# EAGLE design board_0.8v (EAGLE 7.7.0)
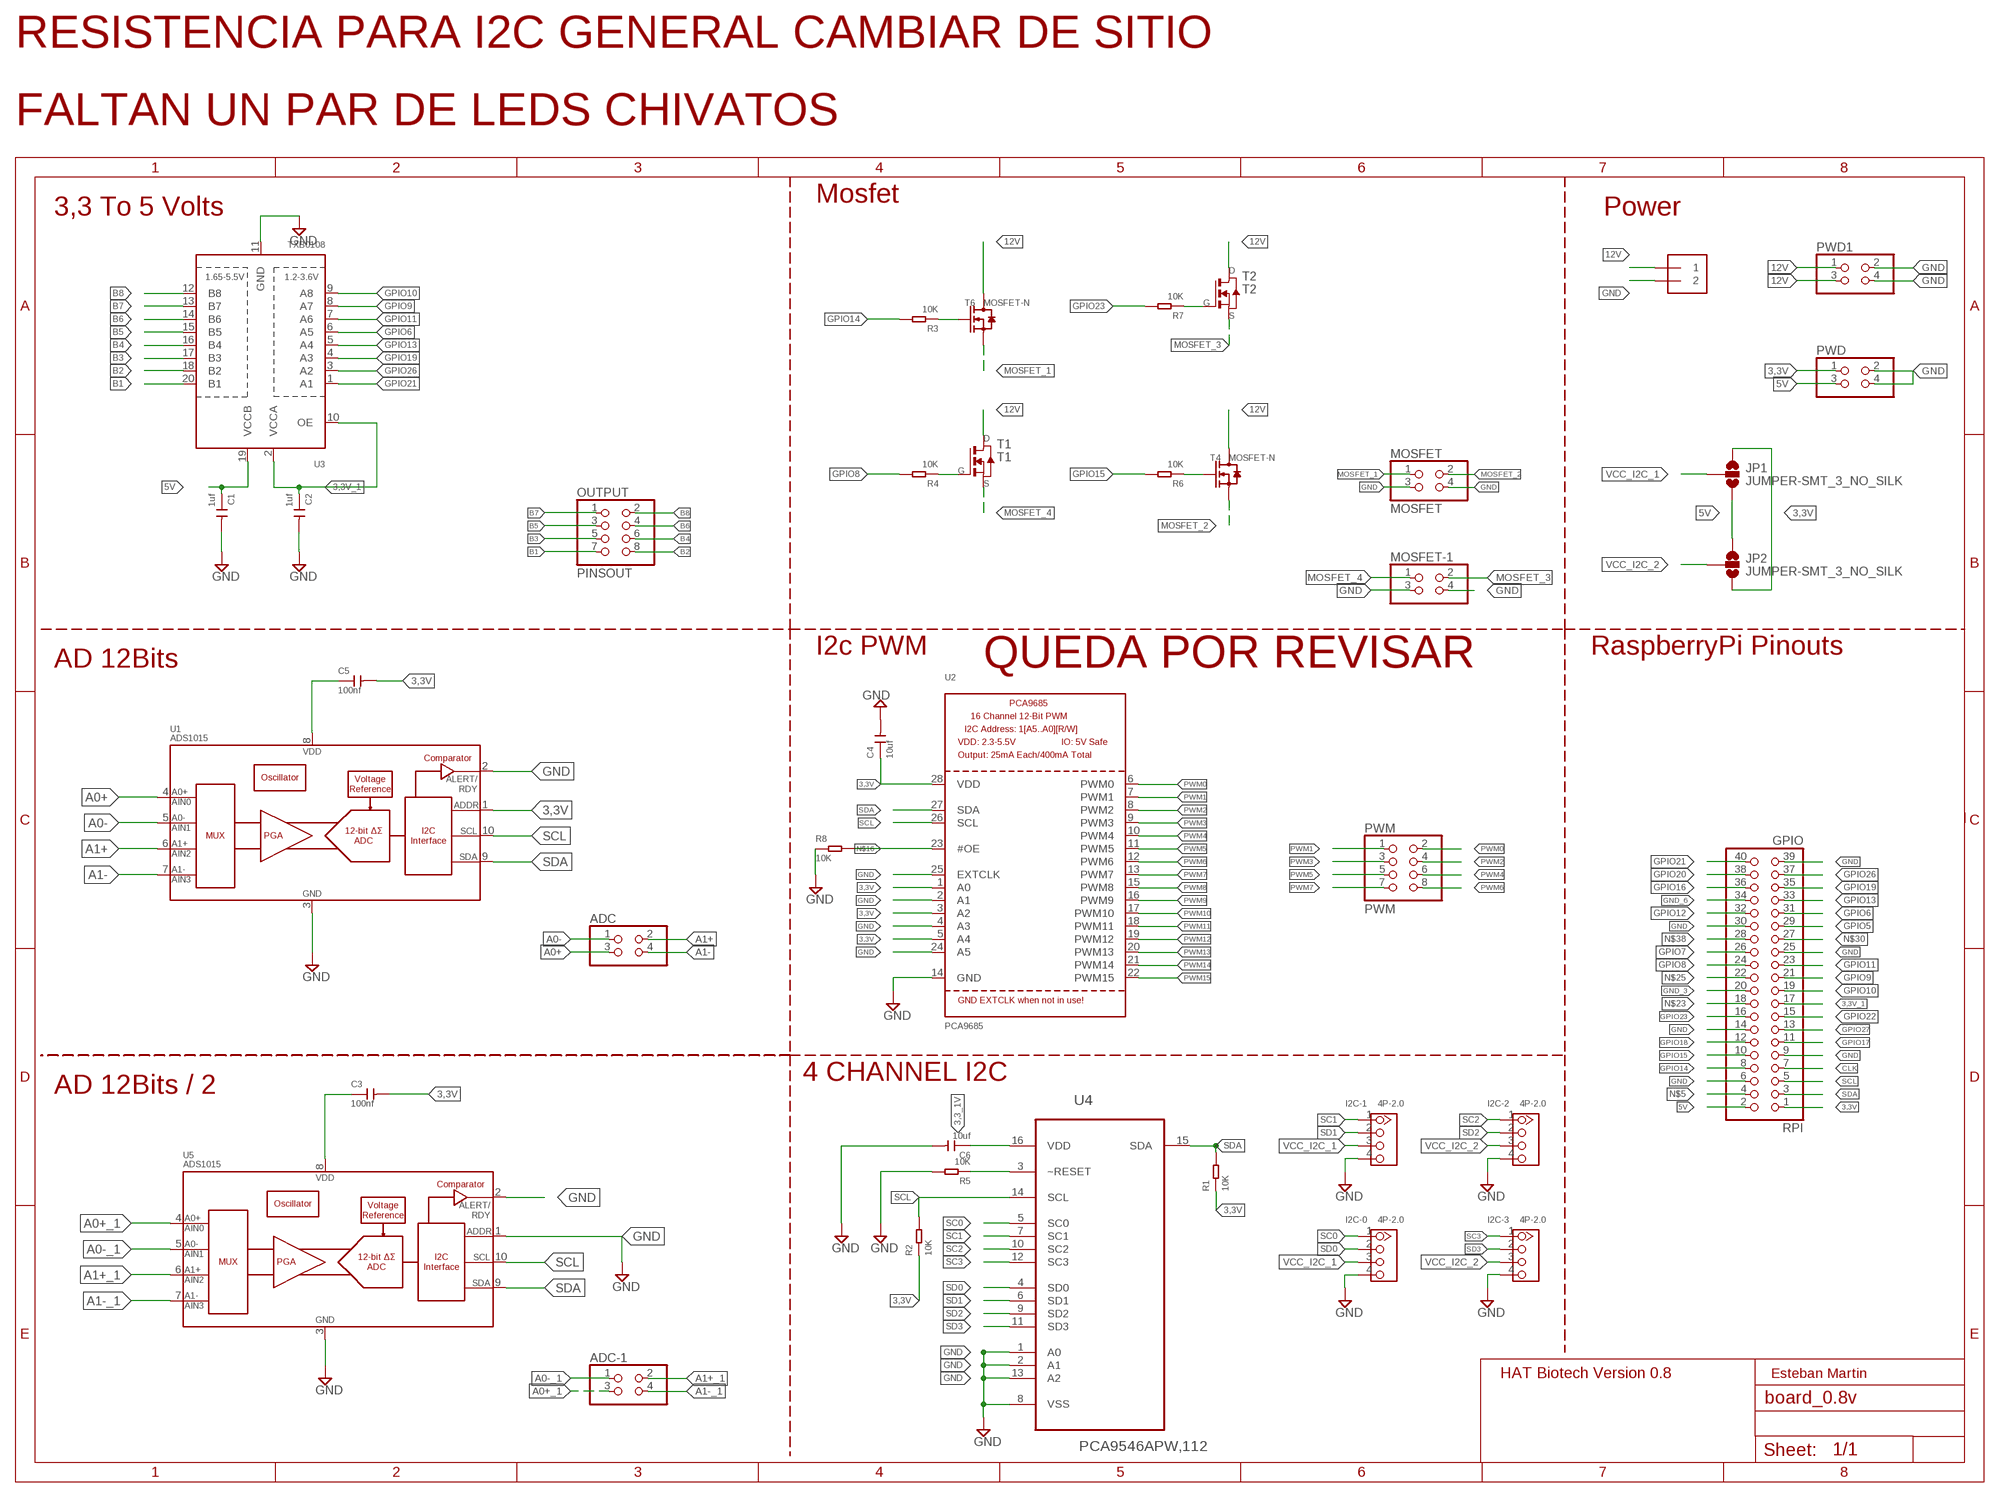
[diagram p0: schematic, sheet 1]

## Parts
ADC  PINHD-2X2  [2X02]
ADC-1  PINHD-2X2  [2X02]
C1  1uf  CERAMIC-1UF-25V-10%-X7R(0805)  [C0805]
C2  1uf  CERAMIC-1UF-25V-10%-X7R(0805)  [C0805]
C3  100nf  CERAMIC-100NF-50V-10%-X7R(0805)  [C0805]
C4  10uf  CERAMIC-1UF-25V-10%-X7R(0805)  [C0805]
C5  100nf  CERAMIC-100NF-50V-10%-X7R(0805)  [C0805]
C6  10uf  CERAMIC-1UF-25V-10%-X7R(0805)  [C0805]
I2C-0  4P-2.0  GROVE-CONNECTOR-DIP(4P-2.0)  [HW4-2.0]
I2C-1  4P-2.0  GROVE-CONNECTOR-DIP(4P-2.0)  [HW4-2.0]
I2C-2  4P-2.0  GROVE-CONNECTOR-DIP(4P-2.0)  [HW4-2.0]
I2C-3  4P-2.0  GROVE-CONNECTOR-DIP(4P-2.0)  [HW4-2.0]
INPUT  1X2-3.5MM  [1X2-3.5MM]
JP1  JUMPER-SMT_3_NO_SILK  [SMT-JUMPER_3_NO_SILK]
JP2  JUMPER-SMT_3_NO_SILK  [SMT-JUMPER_3_NO_SILK]
MOSFET  MOSFET  PINHD-2X2  [2X02]
MOSFET-1  PINHD-2X2  [2X02]
OUTPUT  PINSOUT  PINHD-2X4  [2X04]
PWD  PINHD-2X2  [2X02]
PWD1  PINHD-2X2  [2X02]
PWM  PWM  PINHD-2X4  [2X04]
R1  10K  SMD-RES-10K-1%-1/8W(0805)  [R0805]
R2  10K  SMD-RES-10K-1%-1/8W(0805)  [R0805]
R3  10K  SMD-RES-10K-1%-1/8W(0805)  [R0805]
R4  10K  SMD-RES-10K-1%-1/8W(0805)  [R0805]
R5  10K  SMD-RES-10K-1%-1/8W(0805)  [R0805]
R6  10K  SMD-RES-10K-1%-1/8W(0805)  [R0805]
R7  10K  SMD-RES-10K-1%-1/8W(0805)  [R0805]
R8  10K  SMD-RES-10K-1%-1/8W(0805)  [R0805]
RPI  GPIO  PINHD-2X20  [2X20]
T1  T1  NMOSFETTO252  [TO252]
T2  T2  NMOSFETTO252  [TO252]
T4  MOSFET-N  [SOT-23]
T6  MOSFET-N  [SOT-23]
U1  ADS1015  [MSOP10]
U2  PCA9685  [TSSOP28]
U3  TXB0108  TXB0108PWR  [TSSOP20]
U4  PCA9546APW,112  [SOP65P640X110-16N]
U5  ADS1015  [MSOP10]

## Nets
3,3_1V: C6.1 U4.16(VDD)
3,3V: C3.2 C4.1 C5.2 JP1.1 JP2.3 PWD.1 R1.1 R2.1 RPI.1 U1.1(ADDR) U2.1(A0) U2.3(A2) U2.5(A4) U2.28(VDD)
3,3V_1: C2.1 RPI.17 U3.2(VCCA) U3.10(OE)
5V: C1.1 JP1.3 JP2.1 PWD.3 RPI.2 U3.19(VCCB)
12V: INPUT.1 PWD1.1 PWD1.3 T1.3(D) T2.3(D) T4.3(D) T6.3(D)
A0+: ADC.3 U1.4(AIN0)
A0+_1: ADC-1.3 U5.4(AIN0)
A0-: ADC.1 U1.5(AIN1)
A0-_1: ADC-1.1 U5.5(AIN1)
A1+: ADC.2 U1.6(AIN2)
A1+_1: ADC-1.2 U5.6(AIN2)
A1-: ADC.4 U1.7(AIN3)
A1-_1: ADC-1.4 U5.7(AIN3)
B1: OUTPUT.7 U3.20(B1)
B2: OUTPUT.8 U3.18(B2)
B3: OUTPUT.5 U3.17(B3)
B4: OUTPUT.6 U3.16(B4)
B5: OUTPUT.3 U3.15(B5)
B6: OUTPUT.4 U3.14(B6)
B7: OUTPUT.1 U3.13(B7)
B8: OUTPUT.2 U3.12(B8)
CLK: RPI.7
GND: C1.2 C2.2 C4.2 C6.2 I2C-0.4 I2C-1.4 I2C-2.4 I2C-3.4 INPUT.2 MOSFET-1.3 MOSFET-1.4 MOSFET.3 MOSFET.4 PWD1.2 PWD1.4 PWD.2 PWD.4 R5.2 R8.1 RPI.6 RPI.9 RPI.14 RPI.25 RPI.30 RPI.39 U1.2(ALERT/RDY) U1.3(VSS) U2.2(A1) U2.4(A3) U2.14(GND) U2.24(A5) U2.25(EXTCLK) U3.11(GND) U4.1(A0) U4.2(A1) U4.8(VSS) U4.13(A2) U5.1(ADDR) U5.2(ALERT/RDY) U5.3(VSS)
GND_3: RPI.20
GND_6: RPI.34
GPIO5: RPI.29
GPIO6: RPI.31 U3.6(A5)
GPIO7: RPI.26
GPIO8: R4.2 RPI.24
GPIO9: RPI.21 U3.8(A7)
GPIO10: RPI.19 U3.9(A8)
GPIO11: RPI.23 U3.7(A6)
GPIO12: RPI.32
GPIO13: RPI.33 U3.5(A4)
GPIO14: R3.2 RPI.8
GPIO15: R6.2 RPI.10
GPIO16: RPI.36
GPIO17: RPI.11
GPIO18: RPI.12
GPIO19: RPI.35 U3.4(A3)
GPIO20: RPI.38
GPIO21: RPI.40 U3.1(A1)
GPIO22: RPI.15
GPIO23: R7.2 RPI.16
GPIO26: RPI.37 U3.3(A2)
GPIO27: RPI.13
MOSFET_1: MOSFET.1 T6.2(S)
MOSFET_2: MOSFET.2 T4.2(S)
MOSFET_3: MOSFET-1.2 T2.2(S)
MOSFET_4: MOSFET-1.1 T1.2(S)
N$5: RPI.4
N$6: R3.1 T6.1(G)
N$7: R5.1 U4.3(~RESET)
N$8: C3.1 U5.8(VDD)
N$9: R4.1 T1.1(G)
N$10: R6.1 T4.1(G)
N$11: R7.1 T2.1(G)
N$13: C5.1 U1.8(VDD)
N$16: R8.2 U2.23(#OE)
N$23: RPI.18
N$25: RPI.22
N$30: RPI.27
N$38: RPI.28
PWM0: PWM.2 U2.6(PWM0)
PWM1: PWM.1 U2.7(PWM1)
PWM2: PWM.4 U2.8(PWM2)
PWM3: PWM.3 U2.9(PWM3)
PWM4: PWM.6 U2.10(PWM4)
PWM5: PWM.5 U2.11(PWM5)
PWM6: PWM.8 U2.12(PWM6)
PWM7: PWM.7 U2.13(PWM7)
PWM8: U2.15(PWM8)
PWM9: U2.16(PWM9)
PWM10: U2.17(PWM10)
PWM11: U2.18(PWM11)
PWM12: U2.19(PWM12)
PWM13: U2.20(PWM13)
PWM14: U2.21(PWM14)
PWM15: U2.22(PWM15)
SC0: I2C-0.1 U4.5(SC0)
SC1: I2C-1.1 U4.7(SC1)
SC2: I2C-2.1 U4.10(SC2)
SC3: I2C-3.1 U4.12(SC3)
SCL: R2.2 RPI.5 U1.10(SCL) U2.26(SCL) U4.14(SCL) U5.10(SCL)
SD0: I2C-0.2 U4.4(SD0)
SD1: I2C-1.2 U4.6(SD1)
SD2: I2C-2.2 U4.9(SD2)
SD3: I2C-3.2 U4.11(SD3)
SDA: R1.2 RPI.3 U1.9(SDA) U2.27(SDA) U4.15(SDA) U5.9(SDA)
VCC_I2C_1: I2C-0.3 I2C-1.3 JP1.2
VCC_I2C_2: I2C-2.3 I2C-3.3 JP2.2

## Notes on the sheet
- RESISTENCIA PARA I2C GENERAL CAMBIAR DE SITIO
- FALTAN UN PAR DE LEDS CHIVATOS
- Mosfet
- 3,3 To 5 Volts | Power
- I2c PWM | RaspberryPi Pinouts
- AD 12Bits | QUEDA POR REVISAR
- 4 CHANNEL I2C
- AD 12Bits / 2
- HAT Biotech Version 0.8 | Esteban Martin

## Library data of the parts
ADC ADC-1 MOSFET MOSFET-1 PWD PWD1 = pinhead:PINHD-2X2: PIN HEADER
C1 C2 = Seeed-OPL-Capacitor:CERAMIC-1UF-25V-10%-X7R(0805): 302010179; MPN: CC0805KKX7R8BB105
C3 C5 = Seeed-OPL-Capacitor:CERAMIC-100NF-50V-10%-X7R(0805): 302010165; MPN: CC0805KRX7R9BB104
C4 C6 = Seeed-OPL-Capacitor:CERAMIC-1UF-25V-10%-X7R(0805): 302010179; MPN: CC0805KKX7R8BB105; VALUE: 1uf
I2C-0 I2C-1-I2C-3 = Seeed-OPL-Connector:GROVE-CONNECTOR-DIP(4P-2.0): 320110033
INPUT = adafruit:1X2: 3.5mm Terminal block http://www.ladyada.net/library/pcb/eaglelibrary.html
JP1 JP2 = SparkFun-Jumpers:JUMPER-SMT_3_NO: Normally open jumper This jumper has three pads in close proximity to each other. Apply solder to close the connection(s).
OUTPUT PWM = adafruit:PINHD-2X4: PIN HEADER
R1-R8 = Seeed-OPL-Resistor:SMD-RES-10K-1%-1/8W(0805): 301010361; MPN: RC0805FR-0710KL
RPI = adafruit:PINHD-2X20: PIN HEADER
T1 T2 = fab_2:NMOSFET: MOS FET
T4 T6 = Seeed-OPL-Transistor:MOSFET-N
U1 U5 = SparkFun-IC-Conversion:ADS1015: ADS1015 12-BIT ADC 12-Bit Del-Sig ADC Four single-ended inputs or two differential inputs Internal PGA I2C interface 2.0-5.5V SparkFun Products SparkFun Block for Intel Edison - ADC <https://www.sparkfun.com/products/13770> (DEV-13770); PROD_ID: IC-12270
U2 = adafruit:PCA9685: PCA9685 - 16 Channel 12-Bit I2C PWM Controller 5.0V tolerant 16 channel, 12-bit I2C PWM controller with 25mA per output (max. 400mA total) Digikey: 568-5931-1-ND
U3 = adafruit:TXB0108PWR: 8-Bit Bi-Directional Level Shifter 1.2V-3.6V (VCCA) to 1.65V-5.5V (VCCB) bi-directional level shifter with auto direction sensing. Max data rate - VCCA 1.8V: 20Mbps (50ns), VCCA 3.3V: 100Mbps (10ns) Digikey: 296-21527-1-ND
U4 = NXP_By_element14_Batch_1:PCA9546APW,112: 4-channel I2C-bus switch with reset; MPN: PCA9546APW,112; OC_FARNELL: 1831208; OC_NEWARK: 70R6610; PACKAGE: TSSOP-16; SUPPLIER: NXP

## Board
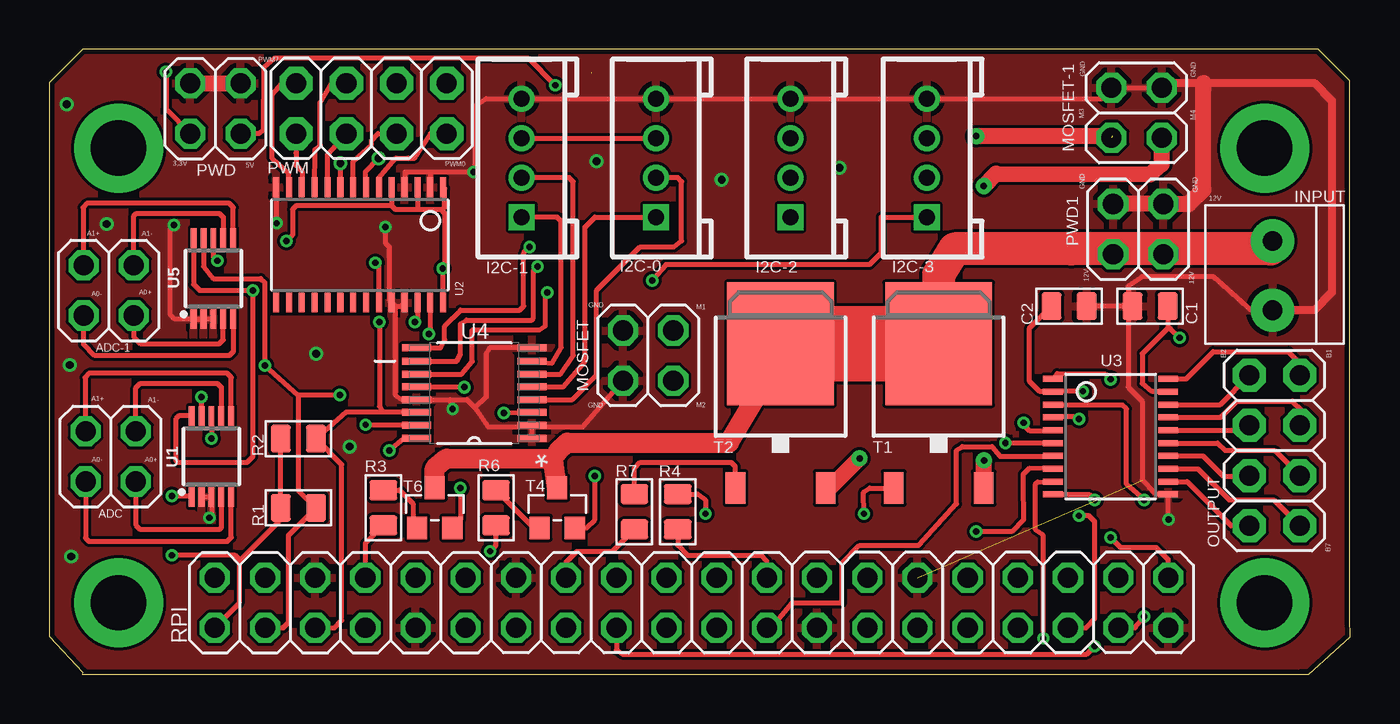
[diagram p1: board, top side]
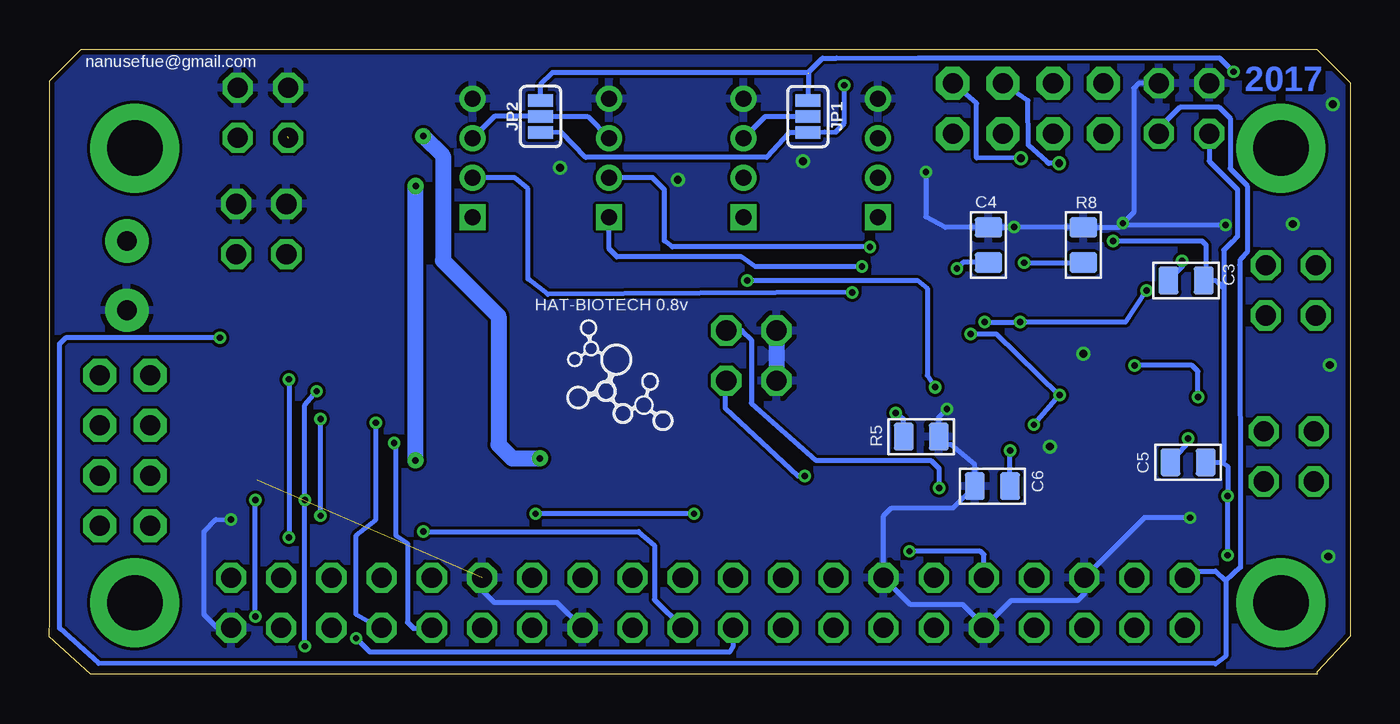
[diagram p2: board, bottom side, seen from below]

Size 65.82 x 31.6 mm. Coordinates in mm from the lower left corner, seen from the top.
Outline: 0,1.91 1.69,0.1 1.67,0 63.34,0 63.74,0 65.82,1.9 65.81,2.79 65.8,30.01 64.21,31.6 1.69,31.6 0,29.91 0,1.91
Copper layers (1*16): Top 0.035mm / dielectric 1.5mm / Bottom 0.035mm
Design rules "SeeedStudio_2layer_DRU_no_angle_20140221": minimum track width 6mil, minimum drill 12mil, track to track 6mil, track to pad 6mil, pad to pad 6mil, via to via 6mil, smd to smd 0mil, copper to edge 10mil, drill to drill 10mil, minimum pad ring 10mil, minimum via ring 6mil, stop-mask expansion 2mil, vias tented up to drill 100mil, thermal gap 10mil

### Footprints (pad centres in the part's own frame; a part is rotated, then mirrored left to right if it is on the bottom)
2X02 = drill 1.016 octagon: 1 -1.27,-1.27; 2 -1.27,1.27; 3 1.27,-1.27; 4 1.27,1.27
C0805 = smd 1.397 x 1.016: 1 0,0.889; 2 0,-0.889
HW4-2.0 = drill 0.8 pad 1.27 square: 1 -3,0 | drill 0.8 pad 1.27: 2 -1,0; 3 1,0; 4 3,0
1X2-3.5MM = drill 1 pad 2.184: 1 1.8,0; 2 -1.7,0
SMT-JUMPER_3_NO_SILK = smd 0.635 x 1.27: 1 -0.813,0; 2 0,0; 3 0.813,0
2X04 = drill 1.016 pad 1.676 octagon: 1 -3.81,-1.27; 2 -3.81,1.27; 3 -1.27,-1.27; 4 -1.27,1.27; 5 1.27,-1.27; 6 1.27,1.27; 7 3.81,-1.27; 8 3.81,1.27
R0805 = smd 1.397 x 1.016: 1 0,0.889; 2 0,-0.889
2X20 = drill 1.016 octagon: 1 -24.13,-1.27; 2 -24.13,1.27; 3 -21.59,-1.27; 4 -21.59,1.27; 5 -19.05,-1.27; 6 -19.05,1.27; 7 -16.51,-1.27; 8 -16.51,1.27; 9 -13.97,-1.27; 10 -13.97,1.27; 11 -11.43,-1.27; 12 -11.43,1.27; 13 -8.89,-1.27; 14 -8.89,1.27; 15 -6.35,-1.27; 16 -6.35,1.27; 17 -3.81,-1.27; 18 -3.81,1.27; 19 -1.27,-1.27; 20 -1.27,1.27; 21 1.27,-1.27; 22 1.27,1.27; 23 3.81,-1.27; 24 3.81,1.27; 25 6.35,-1.27; 26 6.35,1.27; 27 8.89,-1.27; 28 8.89,1.27; 29 11.43,-1.27; 30 11.43,1.27; 31 13.97,-1.27; 32 13.97,1.27; 33 16.51,-1.27; 34 16.51,1.27; 35 19.05,-1.27; 36 19.05,1.27; 37 21.59,-1.27; 38 21.59,1.27; 39 24.13,-1.27; 40 24.13,1.27
TO252 = smd 1 x 1.6: 1 -2.28,-4.8; 2 2.28,-4.8 | smd 5.4 x 6.2: 3 0,2.5
SOT-23 = smd 1.016 x 1.143: 1 -0.889,-1.016; 2 0.889,-1.016; 3 0,1.016
MSOP10 = smd 0.3 x 1: 1 -1,-2.05; 2 -0.5,-2.05; 3 0,-2.05; 4 0.5,-2.05; 5 1,-2.05; 6 1,2.05; 7 0.5,2.05; 8 0,2.05; 9 -0.5,2.05; 10 -1,2.05
TSSOP28 = smd 0.305 x 0.991: 1 -4.225,-2.918; 2 -3.575,-2.918; 3 -2.925,-2.918; 4 -2.275,-2.918; 5 -1.625,-2.918; 6 -0.975,-2.918; 7 -0.325,-2.918; 8 0.325,-2.918; 9 0.975,-2.918; 10 1.625,-2.918; 11 2.275,-2.918; 12 2.925,-2.918; 13 3.575,-2.918; 14 4.225,-2.918; 15 4.225,2.918; 16 3.575,2.918; 17 2.925,2.918; 18 2.275,2.918; 19 1.625,2.918; 20 0.975,2.918; 21 0.325,2.918; 22 -0.325,2.918; 23 -0.975,2.918; 24 -1.625,2.918; 25 -2.275,2.918; 26 -2.925,2.918; 27 -3.575,2.918; 28 -4.225,2.918
TSSOP20 = smd 0.305 x 0.991: 1 -2.925,-2.918; 2 -2.275,-2.918; 3 -1.625,-2.918; 4 -0.975,-2.918; 5 -0.325,-2.918; 6 0.325,-2.918; 7 0.975,-2.918; 8 1.625,-2.918; 9 2.275,-2.918; 10 2.925,-2.918; 11 2.925,2.918; 12 2.275,2.918; 13 1.625,2.918; 14 0.975,2.918; 15 0.325,2.918; 16 -0.325,2.918; 17 -0.975,2.918; 18 -1.625,2.918; 19 -2.275,2.918; 20 -2.925,2.918
SOP65P640X110-16N = smd 1.473 x 0.356: 1 -2.921,2.286; 2 -2.921,1.626; 3 -2.921,0.965; 4 -2.921,0.33; 5 -2.921,-0.33; 6 -2.921,-0.965; 7 -2.921,-1.626; 8 -2.921,-2.286; 9 2.921,-2.286; 10 2.921,-1.626; 11 2.921,-0.965; 12 2.921,-0.33; 13 2.921,0.33; 14 2.921,0.965; 15 2.921,1.626; 16 2.921,2.286

### Placement (x,y rotation side)
ADC  3.1,11.01 0 top
ADC-1  3,19.41 0 top
C1  55.7,18.61 270 top
C2  51.6,18.61 90 top
C3  8.3,19.91 90 bottom
C4  18.3,21.71 180 bottom
C5  8.2,10.71 90 bottom
C6  18.1,9.51 270 bottom
I2C-0  30.7,26.11 90 top
I2C-1  23.9,26.11 90 top
I2C-2  37.5,26.11 90 top
I2C-3  44.4,26.11 90 top
INPUT  61.9,20.11 90 top
JP1  27.44,28.2 270 bottom
JP2  40.96,28.21 90 bottom
MOSFET  30.3,16.11 180 top
MOSFET-1  55.02,28.4 90 top
OUTPUT  62,11.31 90 top
PWD  8.4,28.61 0 top
PWD1  55.1,22.51 0 top
PWM  16.3,28.61 180 top
R1  12.6,8.41 90 top
R2  12.6,11.91 90 top
R3  16.9,8.41 0 top
R4  31.8,8.21 0 top
R5  21.7,12.01 90 bottom
R6  22.6,8.41 0 top
R7  29.6,8.21 0 top
R8  13.5,21.71 0 bottom
RPI  32.5,3.61 0 top
T1  45,14.21 0 top
T2  37,14.21 0 top
T4  25.7,8.41 0 top
T6  19.5,8.41 0 top
U1  8.2,11.01 0 top
U2  15.7,21.71 180 top
U3  53.7,12.01 270 top
U4  21.5,14.21 180 top
U5  8.3,20.01 0 top

### Tracks (layer width: path | path; a pad name or v marks a point on that pad's centre or on a via)
3,3_1V  (via drill 0.32)
  Top 0.254: v17.2,11.31 17.91,11.93 U4.16
  Bottom 0.254: C6.1 17.21,11.02 v17.2,11.31
3,3V  (via drill 0.32)  (1 unrouted)
  Top 0.254: R2.1 R1.1 11.6,7.71 9.6,5.71 | 8.34,2.31 RPI.1 9.6,3.57 9.6,5.71 | v6.2,9.01 7.15,9.01 U1.1 | 9.6,5.71 9.6,5.81 9.4,6.01 v6.2,6.01 | U2.5 17.32,23.69 | 17.32,23.69 17.5,23.51 18.7,23.51 | 19.8,23.51 19.9,23.51 20,23.61 20,24.56 U2.1 | U2.3 18.62,23.59 18.7,23.51 | U2.28 19.9,18.62 v19.9,20.51 20,20.61 20,23.31 19.8,23.51 | 18.7,23.51 19.8,23.51 | 17.32,23.69 12.47,23.69 12.3,23.51 12.3,22.21 v12,21.91 | v5.9,30.47 5.9,28.57 PWD.1
  Bottom 0.254: C5.2 6.5,10.71 | 6.5,10.71 6.2,10.51 v6.2,9.01 v6.2,6.01 | 6.4,19.51 6.8,19.91 C3.2 7.3,20.02 7.3,21.71 7.5,21.91 v12,21.91 | 6.4,19.51 6.4,10.81 6.5,10.71 | C4.1 19.59,20.82 v19.9,20.51 | PWD.1 7.13,25.95 5.7,24.52 5.7,22.14 5.99,21.86 6.4,21.44 6.4,19.51 | 27.41,30.4 JP1.1 | v5.9,30.47 6.61,31.17 21.86,31.17 25.99,31.17 26.69,31.17 27.43,30.43 40.37,30.43 40.99,29.81 40.99,29.05 JP2.3
3,3V_1  (via drill 0.32)
  Top 0.254: RPI.17 28.69,1.22 29,1.01 52.5,1.01 v52.9,1.41 | v52.3,14.31 50.86,14.31 U3.2 50.12,14.29 49.6,14.81 49.6,17.5 C2.1 50.61,18.71 | U3.10 52.62,9.09 v52.9,8.81
  Bottom 0.254: v52.9,1.41 v52.9,8.81 52.9,13.61 v52.3,14.31
5V  (via drill 0.32)
  Top 0.254: C1.1 56.59,17.5 | 56.59,17.5 55.3,16.21 55.3,14.71 55.8,14.31 56.54,14.31 U3.19 | 56.59,17.5 56.71,17.5 v57.2,17.01 | v25.6,29.79 24.24,31.15 11.39,31.15 10.83,30.67 10.83,27.52 10.61,27.34 PWD.3
  Bottom 0.254: RPI.2 8.04,5.21 | 6.3,4.71 6.8,5.21 8.04,5.21 | 6.3,4.71 6.3,0.91 6.8,0.51 63.33,0.54 65.3,2.31 65.3,16.71 65,17.01 v57.2,17.01 | 8.04,5.21 8.2,5.21 | PWD.3 9.67,27.61 8.59,28.7 6.65,28.7 6.07,28.12 6.07,25.57 5.2,24.7 5.2,21.36 5.52,21.01 5.58,20.94 5.59,20.68 5.56,5.4 6.3,4.71 | JP2.1 39.9,27.4 38.68,26.14 29.53,26.14 28.4,27.39 JP1.3 26.6,27.43 26.03,27.42 25.59,27.87 v25.6,29.79
12V
  Top 0.254: 25.49,10.89 25.7,11.21 | 36.5,15.21 36.2,15.21 36.7,15.31 T2.3 | PWD1.3 61.23,21.24 INPUT.1 | PWD1.1 51.97,21.24 51.7,21.51
  Top 1.016: T6.3 19.5,10.41 20.1,10.91 25.49,10.89 T4.3 | 25.7,11.21 26.2,11.71 34.4,11.71 36.5,15.21
  Top 1.676: INPUT.1 61.8,21.91 61.8,21.51 51.7,21.51 45.8,21.51 45,20.21 T1.3
  Top 3.81: T2.3 T1.3
A0+
  Top 0.254: U1.4 8.7,7.41 8.6,7.31 4.6,7.31 4.4,7.51 4.4,9.71 ADC.3
A0+_1
  Top 0.254: ADC-1.3 4.27,17.04 4.6,16.71 8.6,16.71 8.8,16.91 U5.4
A0-
  Top 0.254: ADC.1 1.83,6.88 2,6.71 9,6.71 9.2,6.91 U1.5
A0-_1
  Top 0.254: U5.5 9.3,16.31 9.1,16.11 2.3,16.11 1.73,16.68 ADC-1.1
A1+
  Top 0.254: U1.6 9.2,15.01 9,15.21 2,15.21 1.8,15.01 1.8,12.31 ADC.2
A1+_1
  Top 0.254: U5.6 9.3,23.61 9.1,23.81 1.9,23.81 1.7,23.61 1.7,20.71 ADC-1.2
A1-
  Top 0.254: ADC.4 4.37,14.48 4.6,14.71 8.5,14.71 8.7,14.51 U1.7
A1-_1
  Top 0.254: ADC-1.4 4.27,23.18 4.4,23.31 8.6,23.31 8.8,23.11 U5.7
B1
  Top 0.254: U3.20 57.52,14.94 58.9,16.31 62.7,16.31 63.3,15.71 63.3,15.15 OUTPUT.7
B2
  Top 0.254: U3.18 59.24,13.64 OUTPUT.8
B3
  Top 0.254: U3.17 59.27,12.99 60.1,13.81 62.9,13.81 63.4,13.31 63.4,12.71 OUTPUT.5
B4
  Top 0.254: U3.16 60.48,12.34 OUTPUT.6
B5
  Top 0.254: U3.15 59.12,11.69 59.5,11.31 62,11.31 OUTPUT.3
B6
  Top 0.254: U3.14 58.37,11.04 59.4,10.01 60.7,10.01 OUTPUT.4
B7
  Top 0.254: U3.13 58.12,10.39 59.7,8.81 61.96,8.81 OUTPUT.1
B8
  Top 0.254: U3.12 57.57,9.74 59.81,7.5 OUTPUT.2
GND  (via drill 0.32, 0.4)  (1 unrouted)
  Top 0.254: U4.1 U4.2 24.49,12.51 | C1.2 C2.2 | INPUT.2 60.8,18.41 58.9,20.11 55.3,20.11 54.6,19.61 54.6,18.41 | 54.6,18.41 55,18.01 | 20.3,13.88 U4.13 18.65,13.91 17.8,13.91 17.5,14.11 17.5,18.62 | 20.3,13.88 21.13,13.88 21.55,13.46 | 21.55,13.46 22.2,12.51 24.49,12.51 | 54.6,18.41 54.6,14.51 55.3,13.81 55.3,9.81 55.9,9.21 | 55.9,9.21 55.99,9.11 U3.11 v56.63,7.83 | 55.9,9.21 56,9.11 56.7,9.11 | 23.7,4.79 RPI.14 | 24.49,12.51 27,12.51 MOSFET.4 | v20.4,13.41 20.3,13.88 | U2.4 17.97,24.69 18,25.41 19.3,25.41 | 19.3,25.41 v21.46,25.4 21.55,25.41 21.55,28.75 22.1,29.11 I2C-1.4 I2C-0.4 I2C-2.4 I2C-3.4 53.26,29.11 MOSFET-1.4 MOSFET-1.3 56.6,29.91 | U4.8 22.29,16.5 22.1,16.21 22.1,14.01 21.55,13.46 | U2.2 19.27,24.74 19.3,25.41 | 17.5,18.62 U2.24 17.2,18.92 17.2,21.61 17,21.81 v17,22.61 | 17.5,18.62 17.8,18.62 U2.25 | v11.5,22.81 11.5,24.61 U2.14 | U5.1 U5.2 U5.3 6.35,17.96 6.1,18.21 6.1,22.51 v6.3,22.71 | U1.2 U1.3 8.2,8.01 v8.1,7.91
  Top 0.406: 56.6,29.91 58.4,29.91 64,29.91 64.9,29.01 64.9,19.31 64,18.41 INPUT.2
  Top 0.813: PWD1.2 PWD1.4 57.67,23.78 58.4,24.51 58.4,29.61 58.4,29.91 | PWD.2 PWD.4
  Bottom 0.254: RPI.39 57.33,2.34 58,3.01 58,7.21 57.4,7.81 v56.63,7.83 | v20.4,13.41 20.81,13 R5.2 20.41,11.61 20.2,11.61 18.99,10.6 C6.2 20.09,8.41 23.2,8.41 23.61,8 RPI.14 22.24,3.51 19.6,3.51 18.53,2.44 RPI.9 17.16,3.71 13.8,3.71 13.45,4.06 RPI.6 10.42,7.91 v8.1,7.91 | RPI.25 40.12,3.61 43.3,3.61 43.93,4.24 RPI.30 | C4.2 R8.1 11.71,22.6 v11.5,22.81 | C4.2 20.49,22.6 21.47,23.13 v21.46,25.4 | v6.3,22.71 11.4,22.71 v11.5,22.81 | C4.2 v17.01,22.6 v17,22.61 | PWD.4 10.71,29.88 10.95,29.64 10.95,23.36 v11.5,22.81
  Bottom 0.813: MOSFET.3 MOSFET.4
  other vias: 13.5,16.21 15.2,11.51 27.69,25.93 34.02,25 39.99,25.62 0.88,28.83 2.9,22.77 1.02,15.64 1.11,5.95
  pour Bottom: -0.27,31.92 66.3,31.91 66.3,-0.39 -0.2,-0.09
  pour Top: -0.3,31.71 66.2,31.81 66.2,-0.39 -0.3,-0.49
GPIO6  (via drill 0.32)
  Top 0.254: U3.6 v48.37,11.69
  Bottom 0.254: v48.37,11.69 48.3,11.61 48.3,7.01 47.7,6.61 47.7,2.61 47.4,2.31 46.5,2.31 RPI.31
GPIO8
  Top 0.254: R4.2 31.8,6.51 32.3,6.01 36,6.01 36.3,5.71 36.3,4.89 RPI.24
GPIO9  (via drill 0.32)
  Top 0.254: U3.8 49.6,10.41 49.27,10.09 49.27,9.69 49.3,7.81 48.7,7.21 v46.9,7.21
  Bottom 0.254: v46.9,7.21 36,7.21 35.2,6.51 35.2,3.77 RPI.21
GPIO10  (via drill 0.32)
  Top 0.254: v50.3,1.81 50.3,7.01 49.9,7.31 49.9,9.61 50,9.71 U3.9
  Bottom 0.254: RPI.19 31.23,1.38 31.4,1.11 49.6,1.11 v50.3,1.81
GPIO11
  Top 0.254: RPI.23 36.53,2.34 37.6,3.61 40.1,3.61 40.1,5.61 41,6.51 44,6.51 45.9,8.61 45.9,11.31 46.2,11.51 47.7,11.51 48.1,11.01 50.76,11.01 U3.7
GPIO13  (via drill 0.32)
  Top 0.254: v49.3,12.71 49.3,12.61 49.6,12.31 50.76,12.31 U3.5
  Bottom 0.254: RPI.33 49.13,2.34 50.3,3.01 50.3,7.01 49.3,7.81 v49.3,12.71
GPIO14
  Top 0.254: RPI.8 15.99,6.61 R3.2
GPIO15  (via drill 0.32)
  Top 0.254: v22.3,6.21 22.6,6.51 R6.2
  Bottom 0.254: RPI.10 18.53,6.04 18.7,6.21 v22.3,6.21
GPIO19  (via drill 0.32)
  Top 0.254: RPI.35 52.47,2.34 52.9,2.81 52.9,7.71 52.6,8.01 v52.1,8.01 | v52.1,12.91 52,13.01 50.81,13.01 U3.4
  Bottom 0.254: v52.1,8.01 v52.1,12.91
GPIO21  (via drill 0.32)
  Top 0.254: U3.1 50.82,14.94 51,15.21 53.42,15.19 v53.7,14.91 | v53.7,6.91 54.2,6.41 56,6.41 56.6,5.81 56.6,4.91 RPI.40
  Bottom 0.254: v53.7,14.91 v53.7,6.91
GPIO23
  Top 0.254: RPI.16 26.15,5.66 26.7,6.21 28.49,6.21 R7.2
GPIO26  (via drill 0.32)
  Top 0.254: RPI.37 54.93,2.34 v55.4,2.91 | v55.4,8.81 54.5,9.61 54.5,13.41 54.3,13.61 50.81,13.61 U3.3
  Bottom 0.254: v55.4,2.91 v55.4,8.81
MOSFET_1  (via drill 0.33)
  Top 0.254: v20.8,9.41 20.8,7.81 T6.2
  Bottom 0.254: MOSFET.1 30.77,17.38 30.3,16.91 30.3,13.71 27.02,10.81 21.22,10.81 20.8,10.41 v20.8,9.41
MOSFET_2  (via drill 0.33)
  Top 0.254: T4.2 27.18,7.4 27.6,7.81 v27.6,10.01
  Bottom 0.254: v27.6,10.01 27.94,10.01 31.6,13.41 31.6,14.61 MOSFET.2
MOSFET_3  (via drill 0.33 pad 0.81)  (1 unrouted)
  Top 0.254: 39.48,9.41 T2.2
  Top 0.813: 53.8,27.21 v46.9,27.21 | v41,10.91 39.48,9.41
  Bottom 0.813: v46.9,27.21 45.9,26.21 45.9,20.91 43.1,18.11 43.1,11.61 42.4,10.91 v41,10.91
MOSFET_4  (via drill 0.33 pad 0.81)
  Top 0.813: T1.2 v47.3,10.81 | v47.28,24.69 47.9,25.31 55.71,25.29 56.27,25.77 MOSFET-1.1
  Bottom 0.813: v47.3,10.81 v47.28,24.69
N$1  (via drill 2.8 pad 4.5)
  other vias: 61.5,26.61
N$2  (via drill 2.8 pad 4.5)
  other vias: 3.5,26.61
N$3  (via drill 2.8 pad 4.5)
  other vias: 3.5,3.61
N$4  (via drill 2.8 pad 4.5)
  other vias: 61.5,3.61
N$6
  Top 0.254: R3.1 17.71,9.3 18.4,8.61 18.4,7.61 T6.1
N$7  (via drill 0.32)
  Top 0.254: v23,13.21 U4.3
  Bottom 0.254: R5.1 22.6,12.91 v23,13.21
N$8  (via drill 0.32)
  Top 0.254: U5.8 8.3,21.11 v8.5,20.91
  Bottom 0.254: v8.5,20.91 8.5,20.6 C3.1
N$9  (via drill 0.32)
  Top 0.254: R4.1 32.81,9.1 33.2,8.81 v33.2,8.11 | v41.22,8.11 41.2,9.21 41.5,9.41 T1.1
  Bottom 0.254: v33.2,8.11 v41.22,8.11
N$10
  Top 0.254: T4.1 24.5,7.4 R6.1
N$11
  Top 0.254: R7.1 29.6,10.41 29.9,10.71 34.5,10.71 34.7,10.51 34.7,9.43 T2.1
N$13  (via drill 0.32)
  Top 0.254: U1.8 v8.2,11.91
  Bottom 0.254: v8.2,11.91 8.2,11.7 C5.1
N$16  (via drill 0.32)
  Top 0.254: U2.23 16.67,20.64 v16.5,20.81
  Bottom 0.254: v16.5,20.81 R8.2
PWM0
  Top 0.254: U2.6 16.66,25.09 17.53,26.1 18.18,26.1 18.48,26.11 19.28,27.34 PWM.2
PWM1  (via drill 0.4)
  Top 0.254: U2.7 16.02,24.94 16,25.11 16,25.41 v16.65,26.1
  Bottom 0.254: v16.65,26.1 18.9,26.11 18.9,28.87 PWM.1
PWM2
  Top 0.254: U2.8 15.38,25.95 16.3,26.78 16.3,26.99 16.6,27.31 16.63,27.34 PWM.4
PWM3  (via drill 0.4)
  Top 0.254: U2.9 v14.72,25.84
  Bottom 0.254: v14.72,25.84 15.26,25.83 15.33,25.91 16.29,26.76 16.3,29.01 PWM.3
PWM4
  Top 0.254: U2.10 14.07,26.13 14.07,26.28 PWM.6
PWM5
  Top 0.254: U2.11 13.44,26.54 13.71,26.76 13.7,28.91 14.27,29.88 PWM.5
PWM6
  Top 0.254: PWM.8 12.47,26.36 12.47,25.74 12.8,25.41 U2.12
PWM7
  Top 0.254: U2.13 12.1,24.86 12.11,25.31 11.28,26.08 11.28,29.32 11.77,29.88 PWM.7
SC0
  Top 0.254: U4.5 26.03,14.54 27.1,15.81 27.1,22.61 27.6,23.11 I2C-0.1
SC1
  Top 0.254: U4.7 25.43,15.74 25.9,16.51 25.9,22.91 25.7,23.11 I2C-1.1
SC2  (via drill 0.32 pad 0.3)
  Top 0.254: U4.10 20.63,15.84 20.8,16.21 20.8,17.71 21.1,17.91 24.4,17.91 24.5,18.01 24.5,20.41 v24.7,20.61
  Bottom 0.254: v24.7,20.61 30.1,20.61 30.8,21.11 37.1,21.11 37.5,21.51 I2C-2.1
SC3  (via drill 0.32 pad 0.25, 0.33 pad 0.25)
  Top 0.254: v30.5,19.91 31.2,20.71 41.5,20.71 42.1,21.31 42.1,23.11 I2C-3.1 | v21,14.51 18.71,14.51 U4.12
  Bottom 0.254: v30.5,19.91 21.9,19.91 21.4,19.51 21.4,15.11 v21,14.51
SCL  (via drill 0.32, 0.32 pad 0.3)
  Top 0.254: RPI.5 14.43,2.34 14.8,2.71 14.8,10.6 R2.2 15.02,13.25 16.9,13.25 | U4.14 16.9,13.25 | U2.26 18.62,17.94 v18.5,17.81 | v16.7,17.81 16.7,13.55 16.9,13.25 | U5.10 7.3,19.71 7.6,19.41 v10.3,19.41 10.25,19.36 10.3,19.31 10.3,11.01 10,10.71 6.5,10.71 6.4,10.81 6.4,12.91 6.55,13.06 U1.10
  Bottom 0.254: v18.5,17.81 v16.7,17.81 11.37,17.81 v10.3,19.41
SD0
  Top 0.254: U4.4 26.47,13.88 27.7,15.11 27.7,19.41 29.9,21.61 31.6,21.61 32,21.91 32,24.91 31.8,25.11 I2C-0.2
SD1
  Top 0.254: U4.6 25.86,15.18 26.5,16.11 26.5,24.91 26.3,25.11 I2C-1.2
SD2  (via drill 0.32 pad 0.3)
  Top 0.254: U4.9 19.79,16.5 20,16.91 20,17.61 20.8,18.41 23.8,18.41 24,18.61 24,21.31 v24.3,21.61
  Bottom 0.254: v24.3,21.61 34.3,21.61 34.7,21.91 34.7,24.51 35.3,25.11 I2C-2.2
SD3  (via drill 0.32 pad 0.3)
  Top 0.254: U4.11 20.86,15.18 21.4,15.81 21.4,17.41 24.8,17.41 25.1,17.61 25.1,19.21 v25.2,19.31
  Bottom 0.254: v25.2,19.31 40.6,19.21 41.6,19.99 41.6,23.63 41.6,24.55 42.29,25.11 I2C-3.2
SDA  (via drill 0.32)
  Top 0.254: U5.9 7.8,20.61 8.3,20.01 10.7,20.01 10.9,19.81 v10.9,15.61 12.6,14.11 | 12.6,14.11 12.6,9.3 R1.2 12.1,7.02 12.1,2.61 11.83,2.34 RPI.3 | U4.15 16.03,12.59 v16,12.61 | v14.7,14.11 12.6,14.11 | U1.9 v7.7,14.01 | U2.27 19.27,17.19 v19.2,17.21
  Bottom 0.254: v16,12.61 v14.7,14.11 17.9,17.21 v19.2,17.21 | v7.7,14.01 7.7,15.31 8,15.61 v10.9,15.61
VCC_I2C_1
  Top 0.254: I2C-1.3 I2C-0.3
  Bottom 0.254: JP1.2 29.61,28.2 I2C-0.3
VCC_I2C_2
  Bottom 0.254: I2C-2.3 38.6,28.21 JP2.2 43.3,28.21 I2C-3.3

### Text on the board
Bottom: 2017
bPlace: nanusefue@gmail.com | HAT-BIOTECH 0.8v
tNames: PWM7 | GND | GND | M3 | M4 | 3,3V | 5V | PWM0 | GND | GND | 12V | A1+ | A1- | A0- | A0+ | 12V | 12V | GND | M1 | B2 | B1 | A1+ | A1- | GND | M2 | A0- | A0+ | B7